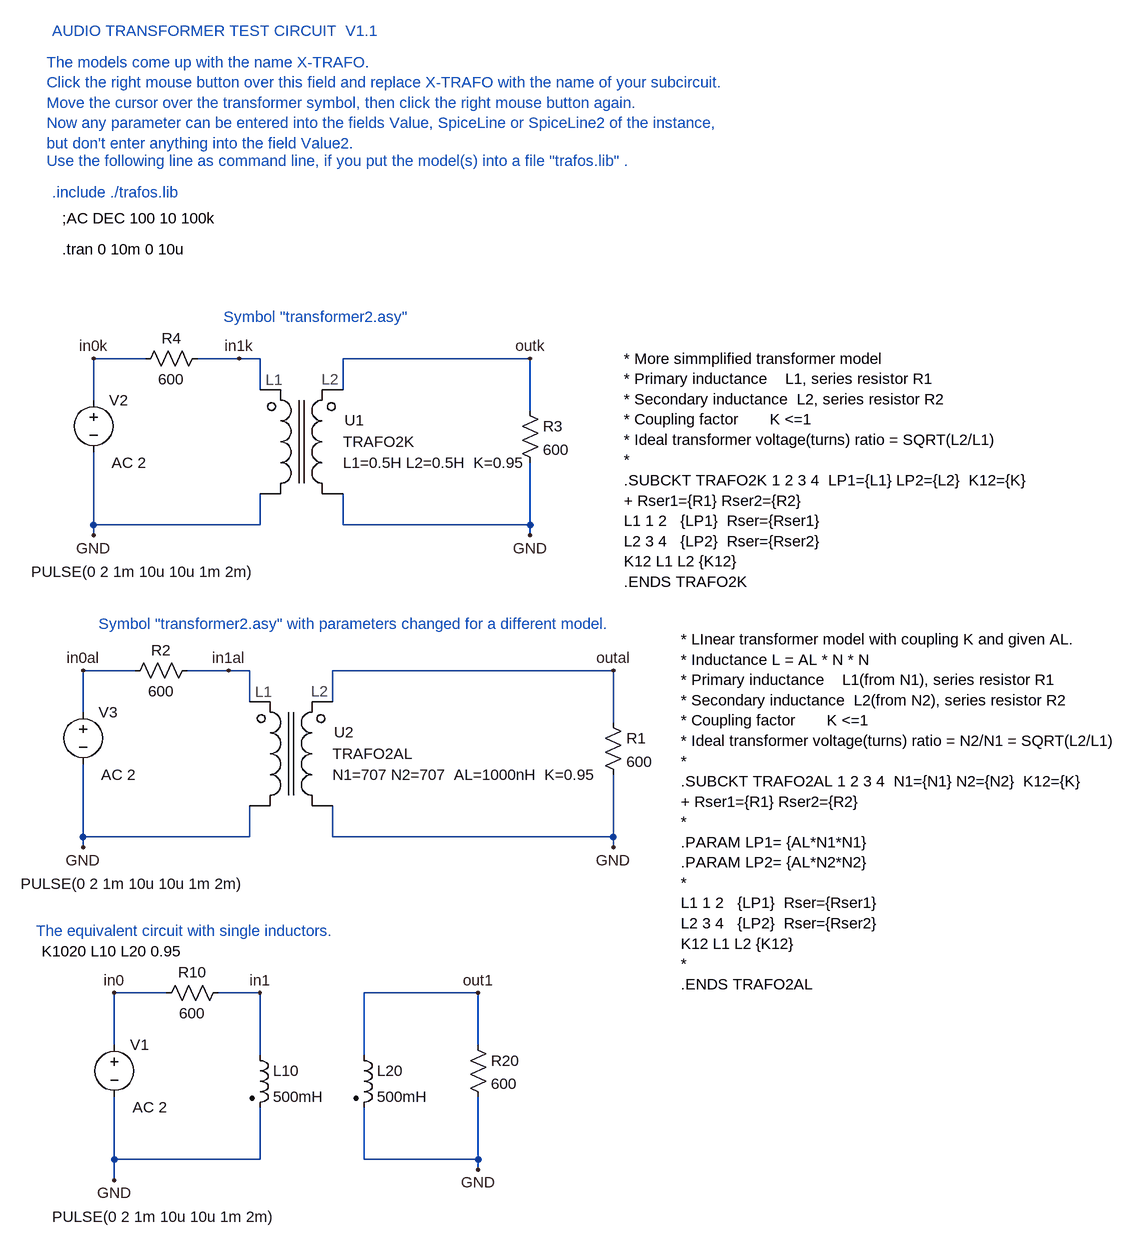
[diagram p0: schematic trafo_test_2coils.asc]
trafo_test_2coils.asc, the LTspice schematic file:
Version 4
SHEET 1 3032 1944
WIRE 1040 1584 960 1584
WIRE 1184 1680 1184 1584
WIRE 1120 1584 1184 1584
WIRE 1344 1680 1344 1584
WIRE 1344 1584 1520 1584
WIRE 1520 1584 1520 1664
WIRE 1520 1744 1520 1840
WIRE 1520 1840 1344 1840
WIRE 1184 1760 1184 1840
WIRE 1184 1840 960 1840
WIRE 1344 1760 1344 1840
WIRE 1520 1840 1520 1856
WIRE 928 608 928 672
WIRE 928 752 928 864
WIRE 1008 608 928 608
WIRE 1088 608 1152 608
WIRE 1312 608 1600 608
WIRE 1600 608 1600 688
WIRE 1600 768 1600 864
WIRE 1600 864 1312 864
WIRE 928 864 928 880
WIRE 1600 864 1600 880
WIRE 1184 656 1184 608
WIRE 1184 608 1152 608
WIRE 1312 656 1312 608
WIRE 1312 816 1312 864
WIRE 1184 816 1184 864
WIRE 1184 864 928 864
WIRE 960 1584 960 1664
WIRE 960 1744 960 1840
WIRE 960 1840 960 1872
WIRE 912 1088 912 1152
WIRE 912 1232 912 1344
WIRE 992 1088 912 1088
WIRE 1072 1088 1136 1088
WIRE 1296 1088 1728 1088
WIRE 1728 1088 1728 1168
WIRE 1728 1248 1728 1344
WIRE 1728 1344 1296 1344
WIRE 912 1344 912 1360
WIRE 1728 1344 1728 1360
WIRE 1168 1136 1168 1088
WIRE 1168 1088 1136 1088
WIRE 1296 1136 1296 1088
WIRE 1296 1296 1296 1344
WIRE 1168 1296 1168 1344
WIRE 1168 1344 912 1344
FLAG 960 1584 in0
FLAG 1520 1584 out1
FLAG 1520 1856 GND
FLAG 1184 1584 in1
FLAG 928 880 GND
FLAG 928 608 in0k
FLAG 1600 608 outk
FLAG 1600 880 GND
FLAG 1152 608 in1k
FLAG 960 1872 GND
FLAG 912 1360 GND
FLAG 912 1088 in0al
FLAG 1728 1088 outal
FLAG 1728 1360 GND
FLAG 1136 1088 in1al
SYMBOL ind2 1168 1664 R0
SYMATTR InstName L10
SYMATTR Value 500mH
SYMBOL ind2 1328 1664 R0
SYMATTR InstName L20
SYMATTR Value 500mH
SYMBOL res 1504 1648 R0
SYMATTR InstName R20
SYMATTR Value 600
SYMBOL res 1024 1600 R270
WINDOW 0 32 56 VTop 0
WINDOW 3 0 56 VBottom 0
SYMATTR InstName R10
SYMATTR Value 600
SYMBOL res 1584 672 R0
SYMATTR InstName R3
SYMATTR Value 600
SYMBOL res 992 624 R270
WINDOW 0 32 56 VTop 0
WINDOW 3 0 56 VBottom 0
SYMATTR InstName R4
SYMATTR Value 600
SYMBOL VOLTAGE 928 656 R0
WINDOW 39 0 0 Left 0
WINDOW 123 28 112 Left 0
WINDOW 3 -96 280 Left 0
SYMATTR Value2 AC 2
SYMATTR Value PULSE(0 2 1m 10u 10u 1m 2m)
SYMATTR InstName V2
SYMBOL VOLTAGE 960 1648 R0
WINDOW 39 0 0 Left 0
WINDOW 123 28 112 Left 0
WINDOW 3 -96 280 Left 0
SYMATTR Value2 AC 2
SYMATTR Value PULSE(0 2 1m 10u 10u 1m 2m)
SYMATTR InstName V1
SYMBOL Private\\transformer2 1168 656 R0
SYMATTR InstName U1
SYMATTR SpiceLine L1=0.5H L2=0.5H  K=0.95
SYMATTR SpiceModel TRAFO2K
SYMBOL res 1712 1152 R0
SYMATTR InstName R1
SYMATTR Value 600
SYMBOL res 976 1104 R270
WINDOW 0 32 56 VTop 0
WINDOW 3 0 56 VBottom 0
SYMATTR InstName R2
SYMATTR Value 600
SYMBOL VOLTAGE 912 1136 R0
WINDOW 39 0 0 Left 0
WINDOW 123 28 112 Left 0
WINDOW 3 -96 280 Left 0
SYMATTR Value2 AC 2
SYMATTR Value PULSE(0 2 1m 10u 10u 1m 2m)
SYMATTR InstName V3
SYMBOL Private\\transformer2 1152 1136 R0
SYMATTR InstName U2
SYMATTR SpiceLine N1=707 N2=707  AL=1000nH  K=0.95
SYMATTR SpiceModel TRAFO2AL
TEXT 880 392 Left 0 !;AC DEC 100 10 100k
TEXT 864 352 Left 0 ;.include ./trafos.lib
TEXT 880 440 Left 0 !.tran 0 10m 0 10u
TEXT 864 104 Left 0 ;AUDIO TRANSFORMER TEST CIRCUIT  V1.1
TEXT 848 1520 Left 0 !K1020 L10 L20 0.95
TEXT 840 1488 Left 0 ;The equivalent circuit with single inductors.
TEXT 1744 608 Left 0 !* More simmplified transformer model\n* Primary inductance    L1, series resistor R1\n* Secondary inductance  L2, series resistor R2\n* Coupling factor       K <=1\n* Ideal transformer voltage(turns) ratio = SQRT(L2/L1)\n*\n.SUBCKT TRAFO2K 1 2 3 4  LP1={L1} LP2={L2}  K12={K}\n+ Rser1={R1} Rser2={R2}\nL1 1 2   {LP1}  Rser={Rser1}\nL2 3 4   {LP2}  Rser={Rser2}\nK12 L1 L2 {K12}\n.ENDS TRAFO2K
TEXT 1832 1040 Left 0 !* LInear transformer model with coupling K and given AL.\n* Inductance L = AL * N * N\n* Primary inductance    L1(from N1), series resistor R1\n* Secondary inductance  L2(from N2), series resistor R2\n* Coupling factor       K <=1\n* Ideal transformer voltage(turns) ratio = N2/N1 = SQRT(L2/L1)\n*\n.SUBCKT TRAFO2AL 1 2 3 4  N1={N1} N2={N2}  K12={K}\n+ Rser1={R1} Rser2={R2}\n*\n.PARAM LP1= {AL*N1*N1}\n.PARAM LP2= {AL*N2*N2}\n*\nL1 1 2   {LP1}  Rser={Rser1}\nL2 3 4   {LP2}  Rser={Rser2}\nK12 L1 L2 {K12}\n*\n.ENDS TRAFO2AL
TEXT 1128 544 Left 0 ;Symbol "transformer2.asy"
TEXT 936 1016 Left 0 ;Symbol "transformer2.asy" with parameters changed for a different model.
TEXT 856 152 Left 0 ;The models come up with the name X-TRAFO.\nClick the right mouse button over this field and replace X-TRAFO with the name of your subcircuit.\nMove the cursor over the transformer symbol, then click the right mouse button again.\nNow any parameter can be entered into the fields Value, SpiceLine or SpiceLine2 of the instance, \nbut don't enter anything into the field Value2.
TEXT 856 304 Left 0 ;Use the following line as command line, if you put the model(s) into a file "trafos.lib" .

The netlist it stands for:
* trafo_test_2coils.asc
L10 in1 GND 500mH
L20 out1 GND 500mH
R20 out1 GND 600
R10 in0 in1 600
R3 outk GND 600
R4 in0k in1k 600
V2 in0k GND PULSE(0 2 1m 10u 10u 1m 2m) AC 2
V1 in0 GND PULSE(0 2 1m 10u 10u 1m 2m) AC 2
XU1 in1k GND outk GND TRAFO2K L1=0.5H L2=0.5H  K=0.95 R1=1m R2=1m  ; pins A B C D
R1 outal GND 600
R2 in0al in1al 600
V3 in0al GND PULSE(0 2 1m 10u 10u 1m 2m) AC 2
XU2 in1al GND outal GND TRAFO2AL N1=707 N2=707  AL=1000nH  K=0.95 R1=1m R2=1m  ; pins A B C D
;AC DEC 100 10 100k
* .include ./trafos.lib
.tran 0 10m 0 10u
* AUDIO TRANSFORMER TEST CIRCUIT  V1.1
K1020 L10 L20 0.95
* The equivalent circuit with single inductors.
* More simmplified transformer model
* Primary inductance    L1, series resistor R1
* Secondary inductance  L2, series resistor R2
* Coupling factor       K <=1
* Ideal transformer voltage(turns) ratio = SQRT(L2/L1)
*
.SUBCKT TRAFO2K 1 2 3 4  LP1={L1} LP2={L2}  K12={K}
+ Rser1={R1} Rser2={R2}
L1 1 2   {LP1}  Rser={Rser1}
L2 3 4   {LP2}  Rser={Rser2}
K12 L1 L2 {K12}
.ENDS TRAFO2K
* LInear transformer model with coupling K and given AL.
* Inductance L = AL * N * N
* Primary inductance    L1(from N1), series resistor R1
* Secondary inductance  L2(from N2), series resistor R2
* Coupling factor       K <=1
* Ideal transformer voltage(turns) ratio = N2/N1 = SQRT(L2/L1)
*
.SUBCKT TRAFO2AL 1 2 3 4  N1={N1} N2={N2}  K12={K}
+ Rser1={R1} Rser2={R2}
*
.PARAM LP1= {AL*N1*N1}
.PARAM LP2= {AL*N2*N2}
*
L1 1 2   {LP1}  Rser={Rser1}
L2 3 4   {LP2}  Rser={Rser2}
K12 L1 L2 {K12}
*
.ENDS TRAFO2AL
* Symbol "transformer2.asy"
* Symbol "transformer2.asy" with parameters changed for a different model.
* The models come up with the name X-TRAFO.
* Click the right mouse button over this field and replace X-TRAFO with the name of your subcircuit.
* Move the cursor over the transformer symbol, then click the right mouse button again.
* Now any parameter can be entered into the fields Value, SpiceLine or SpiceLine2 of the instance,
* but don't enter anything into the field Value2.
* Use the following line as command line, if you put the model(s) into a file "trafos.lib" .
.backanno
.end